# Altium schematic sheet T8105原理图.SchDoc
size A4
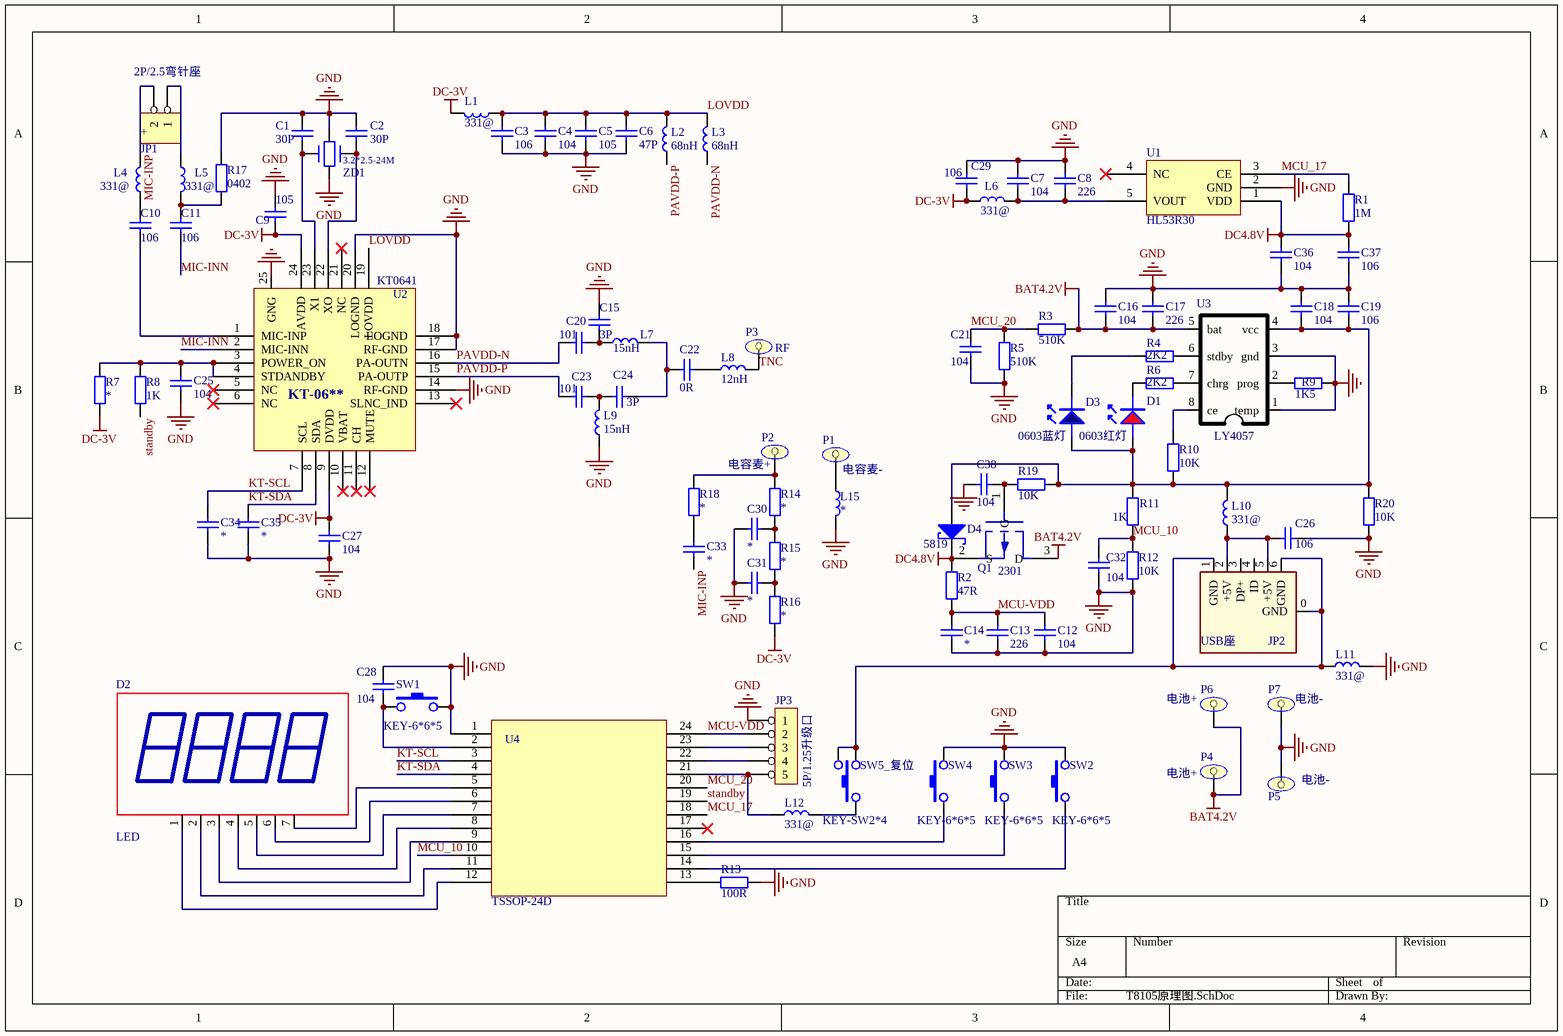
[diagram p0: T8105原理图.SchDoc]

## Parts
C1  30P  [C0402]
C2  30P  [C0402]
C3  106  [C0603]
C4  104  [C0402]
C5  105  [C0402]
C6  47P  [C0402]
C7  104  [C0402]
C8  226  [C0603]
C9  105  [C0402]
C10  106  [C0603]
C11  106  [C0603]
C12  104  [C0402]
C13  226  [C0603]
C14  *  [C1206]
C15  3P  [C0402]
C16  104  [C0402]
C17  226  [C0603]
C18  104  [C0402]
C19  106  [C0603]
C20  101  [C0402]
C21  104  [C0402]
C22  0R  [C0402]
C23  101  [C0402]
C24  3P  [C0402]
C25  104  [C0402]
C26  106  [C0603]
C27  104  [C0402]
C28  104  [C0402]
C29  106  [C0603]
C30  *  [C0603]
C31  *  [C0603]
C32  104  [C0402]
C33  *  [C0603]
C34  *  [C0402]
C35  *  [C0402]
C36  104  [C0402]
C37  106  [C0603]
C38  104  [C0402]
D1  0603红灯  [LED-0603]
D2  LED  [LED-15*16*7-7pin]
D3  0603蓝灯  [LED-0603]
D4  5819  [SOD-123]
JP1  2P/2.5弯针座  [2P针座-2.54MM_弯针]
JP2  USB座  [USB-TYPE-C3.1-6]
JP3  5P/1.25升级口  [5P插针-12.5MM]
L1  331@  [L0402]
L2  68nH  [L0603]
L3  68nH  [L0402]
L4  331@  [L0402]
L5  331@  [L0402]
L6  331@  [L0402]
L7  15nH  [L0402]
L8  12nH  [L0402]
L9  15nH  [L0402]
L10  331@  [L0805]
L11  331@  [L0805]
L12  331@  [L0402]
L15  *  [L0603]
P1  电容麦-  [2.2mm焊盘]
P2  电容麦+  [2.2mm焊盘]
P3  RF  [2.2mm焊盘]
P4  电池+  [2.2mm焊盘]
P5  电池-  [2.2mm焊盘]
P6  电池+  [2.2mm焊盘]
P7  电池-  [2.2mm焊盘]
Q1  2301  [SOT-23-3]
R1  1M  [R0402]
R2  47R  [R0402]
R3  510K  [R0402]
R4  2K2  [R0402]
R5  510K  [R0402]
R6  2K2  [R0402]
R7  *  [R0402]
R8  1K  [R0402]
R9  1K5  [R0402]
R10  10K  [R0402]
R11  1K  [R0402]
R12  10K  [R0402]
R13  100R  [R0402]
R14  *  [R0402]
R15  *  [R0402]
R16  *  [R0402]
R17  0402  [R0402]
R18  *  [R0402]
R19  10K  [R0402]
R20  10K  [R0402]
SW1  KEY-6*6*5  [KEY-6*6*5]
SW2  KEY-6*6*5  [KEY-6*6*5]
SW3  KEY-6*6*5  [KEY-6*6*5]
SW4  KEY-6*6*5  [KEY-6*6*5]
SW5_复位  KEY-SW2*4  [KEY_SW2X4]
U1  HL53R30  [SOT-23-5]
U2  KT0641  [QFN-24脚-4X4X0.5P]
U3  LY4057  [SOP-8-150]
U4  TSSOP-24D  [TSSOP-24]
ZD1  3.2*2.5-24M  [SMD-3.2*2.5]

## Nets
BAT4.2V: C16.1 C17.1 P4.1 P6.1 Q1.3(D) R3.1 U3.5(bat)
DC4.8V: C36.1 C37.2 D4.2(K) Q1.2(S) R1.1 R2.1 U1.1(VDD)
DC-3V: C9.2 C27.2 C29.1 L1.2 L6.1 R7.2 R16.2 U2.9(DVDD) U2.24(AVDD)
GND: C1.2 C2.2 C3.2 C4.1 C5.2 C6.2 C7.1 C8.2 C9.1 C12.1 C13.1 C14.1 C15.1 C16.2 C17.2 C18.2 C19.2 C21.1 C25.2 C26.2 C27.1 C28.2 C29.2 C30.1 C31.1 C32.1 C34.1 C35.1 C36.2 C37.1 C38.1 JP3.1 L9.1 L11.2 L15.2 P5.1 P7.1 R5.1 R9.1 R12.1 R13.2 R17.2 R20.2 SW1.2 SW2.2 SW3.2 SW4.2 U1.2(GND) U2.14(RF-GND) U2.17(RF-GND) U2.18(LOGND) U2.20(LOGND) U2.25(GNG) U3.1(temp) U3.3(gnd) U4.1 ZD1.2 ZD1.4
KT-SCL: C34.2 U2.7(SCL) U4.3
KT-SDA: C35.2 U2.8(SDA) U4.4
LOVDD: C3.1 C4.2 C5.1 C6.1 L1.1 L2.2 L3.2 U2.19(LOVDD)
MCU-VDD: C12.2 C13.2 C14.2 JP3.2 R2.2 U4.24
MCU_10: C32.2 R11.1 R12.2 U4.10
MCU_17: R1.2 U1.3(CE) U4.18
MCU_20: C21.2 R3.2 R5.2 U4.20
MIC-INN: C11.1 U2.2(MIC-INN)
MIC-INP: C33.1 JP1.2 L4.2
PAVDD-N: C20.2 L3.1 U2.16(PA-OUTN)
PAVDD-P: C23.2 L2.1 U2.15(PA-OUTP)
standby: R8.1 U4.19
TNC: L8.2 P3.1
NetC1_1: C1.1 U2.23(X1) ZD1.1
NetC2_1: C2.1 U2.22(XO) ZD1.3
NetC7_2: C7.2 C8.1 L6.2 U1.5(VOUT)
NetC10_1: C10.1 U2.1(MIC-INP)
NetC10_2: C10.2 L4.1
NetC11_2: C11.2 L5.2 R17.1
NetC15_2: C15.2 C20.1 L7.1
NetC18_1: C18.1 C19.1 D1.1 D3.1 D4.1(A) L10.2 R10.1 R11.2 R19.2 R20.1 U3.4(vcc)
NetC22_1: C22.1 C24.2 L7.2
NetC22_2: C22.2 L8.1
NetC23_1: C23.1 C24.1 L9.2
NetC25_1: C25.1 R7.1 R8.2 U2.3(POWER_ON) U2.4(STDANDBY)
NetC26_1: C26.1 JP2.2(+5V) JP2.5(+5V) L10.1
NetC28_1: C28.1 SW1.1 U4.2
NetC30_2: C30.2 R14.1 R15.2
NetC31_2: C31.2 R15.1 R16.1
NetC33_2: C33.2 R18.1
NetC38_2: C38.2 Q1.1(G) R19.1
NetD1_2: D1.2 R6.1
NetD2_1: D2.1 U4.12
NetD2_2: D2.2 U4.11
NetD2_3: D2.3 U4.9
NetD2_4: D2.4 U4.8
NetD2_5: D2.5 U4.7
NetD2_6: D2.6 U4.6
NetD2_7: D2.7 U4.5
NetD3_2: D3.2 R4.1
NetJP1_1: JP1.1 L5.1
NetJP2_0: JP2.0(GND) JP2.1(GND) JP2.6(GND) L11.1 SW5_复位.2 SW5_复位.3
NetJP3_3: JP3.3 U4.23
NetJP3_4: JP3.4 U4.22
NetJP3_5: JP3.5 L12.1 U4.21
NetL12_2: L12.2 SW5_复位.1
NetL15_1: L15.1 P1.1
NetP2_1: P2.1 R14.2 R18.2
NetR4_2: R4.2 U3.6(stdby)
NetR6_2: R6.2 U3.7(chrg)
NetR9_2: R9.2 U3.2(prog)
NetR10_2: R10.2 U3.8(ce)
NetR13_1: R13.1 U4.13
NetSW2_1: SW2.1 U4.14
NetSW3_1: SW3.1 U4.15
NetSW4_1: SW4.1 U4.16

Not connected (* = marked no-connect by the designer): JP2 3(DP+) 4(ID); U1 4(NC)*; U2 5(NC)* 6(NC)* 10(VBAT)* 11(CH)* 12(MUTE)* 13(SLNC_IND)* 21(NC)*; U4 17*

## Notes on the sheet
- +
- (in symbol QFN-24-4X4X0.5（0642/43）) KT-06**

## Library data of the parts
C1 C2 C4-C7 C9 C12 C15 C16 C18 C20-C25 C27 C28 C32 C34-C36 C38 = C0402: 贴片电容; ComponentLink1Description: 供应商链接; ComponentLink1URL: http://www.szlcsc.com/product/details_53938.html; Package: 0402; Supplier: LC; SuppliersPartNumber: C52923
C3 C8 C10 C11 C13 C17 C19 C26 C29-C31 C33 C37 = C0603: 贴片电容; ComponentLink1Description: 供应商链接; ComponentLink1URL: http://www.szlcsc.com/product/details_1875.html; Package: 0402; Supplier: LC; SuppliersPartNumber: C1523
C14 = C1206: 贴片电容; ComponentLink1Description: 供应商链接; ComponentLink1URL: http://www.szlcsc.com/product/details_25237.html; Package: 1206; Supplier: LC; SuppliersPartNumber: C24497
D1 = LED-0603: 贴片LED
D2 = LED-15*16/数码管: 数码管
D3 = LED-0603_蓝: 贴片LED
D4 = SOD-123: 贴片肖特基二极管
JP1 = 2P/2.5弯针座: 直插针座
JP2 = USB-TYPE-C3.1-6: 直插USB充电座
JP3 = 5P/1.25插针: 直插插针
L1 L3-L9 L12 = L0402: 贴片电感; ComponentLink1Description: 供应商链接; ComponentLink1URL: http://www.szlcsc.com/product/details_1913.html; Package: 0402; Supplier: LC; SuppliersPartNumber: C1561
L2 L15 = L0603: 贴片电感; ComponentLink1Description: 供应商链接; ComponentLink1URL: http://www.szlcsc.com/product/details_15331.html; Package: 0603; Supplier: LC; SuppliersPartNumber: C14663
L10 L11 = L0805: 贴片电感; ComponentLink1Description: 供应商链接; ComponentLink1URL: http://www.szlcsc.com/product/details_2068.html; Package: 0805; Supplier: LC; SuppliersPartNumber: C1716
P1-P7 = 测试焊点: 测试焊盘
Q1 = SOT-23-MOS: 贴片MOS三极管
R1-R20 = R0402: 贴片电阻; ComponentLink1Description: 供应商链接; ComponentLink1URL: http://www.szlcsc.com/product/details_1902.html; Package: 0402; Supplier: LC; SuppliersPartNumber: C1550
SW1-SW4 = KEY-6*6*5: 贴片按键
SW5_复位 = KEY-SW2*4: 贴片按键
U1 = SOT-23-5_HL53R33: 贴片三极管
U2 = QFN-24-4X4X0.5（0642/43）
U3 = LY4057: 充电管理
U4 = TSSOP-24: 贴片集成块
ZD1 = ZD-3.2*2.5: 贴片晶振